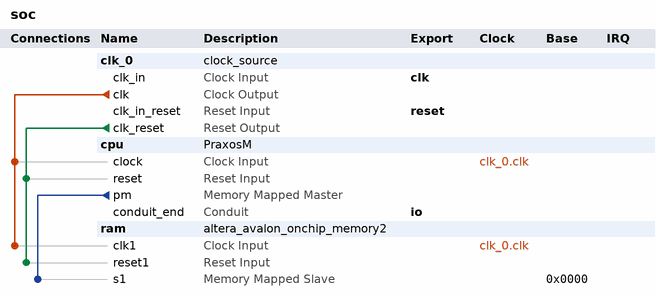
[diagram p0: system contents]
# Platform Designer (Qsys) system soc, Cyclone 10 LP 10CL010YE144I7G
# Parameters at their usual value, and those the tool derives, are not listed.
package require -exact qsys 18.1
create_system soc
set_project_property DEVICE_FAMILY {Cyclone 10 LP}
set_project_property DEVICE 10CL010YE144I7G

add_instance clk_0 clock_source 18.1
set_instance_parameter_value clk_0 clockFrequency 64000000
set_instance_parameter_value clk_0 resetSynchronousEdges DEASSERT

add_instance cpu PraxosM 1.0
set_instance_parameter_value cpu DM_WIDTH 8
set_instance_parameter_value cpu IO_FLAG_WIDTH 1
set_instance_parameter_value cpu PM_WIDTH 8

add_instance ram altera_avalon_onchip_memory2 18.1
set_instance_parameter_value ram dataWidth 32
set_instance_parameter_value ram dualPort false
set_instance_parameter_value ram initMemContent true
set_instance_parameter_value ram initializationFileName onchip_mem.hex
set_instance_parameter_value ram memorySize 1024

# connections
add_connection clk_0.clk cpu.clock clock
add_connection clk_0.clk ram.clk1 clock
add_connection clk_0.clk_reset cpu.reset reset
add_connection clk_0.clk_reset ram.reset1 reset
add_connection cpu.pm ram.s1 avalon
set_connection_parameter_value cpu.pm/ram.s1 baseAddress 0x0000

# exported interfaces
add_interface clk clock sink
set_interface_property clk EXPORT_OF clk_0.clk_in
add_interface io conduit end
set_interface_property io EXPORT_OF cpu.conduit_end
add_interface reset reset sink
set_interface_property reset EXPORT_OF clk_0.clk_in_reset

set_interconnect_requirement {$system} qsys_mm.clockCrossingAdapter HANDSHAKE
set_interconnect_requirement {$system} qsys_mm.enableEccProtection FALSE
set_interconnect_requirement {$system} qsys_mm.insertDefaultSlave FALSE
set_interconnect_requirement {$system} qsys_mm.maxAdditionalLatency 1

save_system soc.qsys
